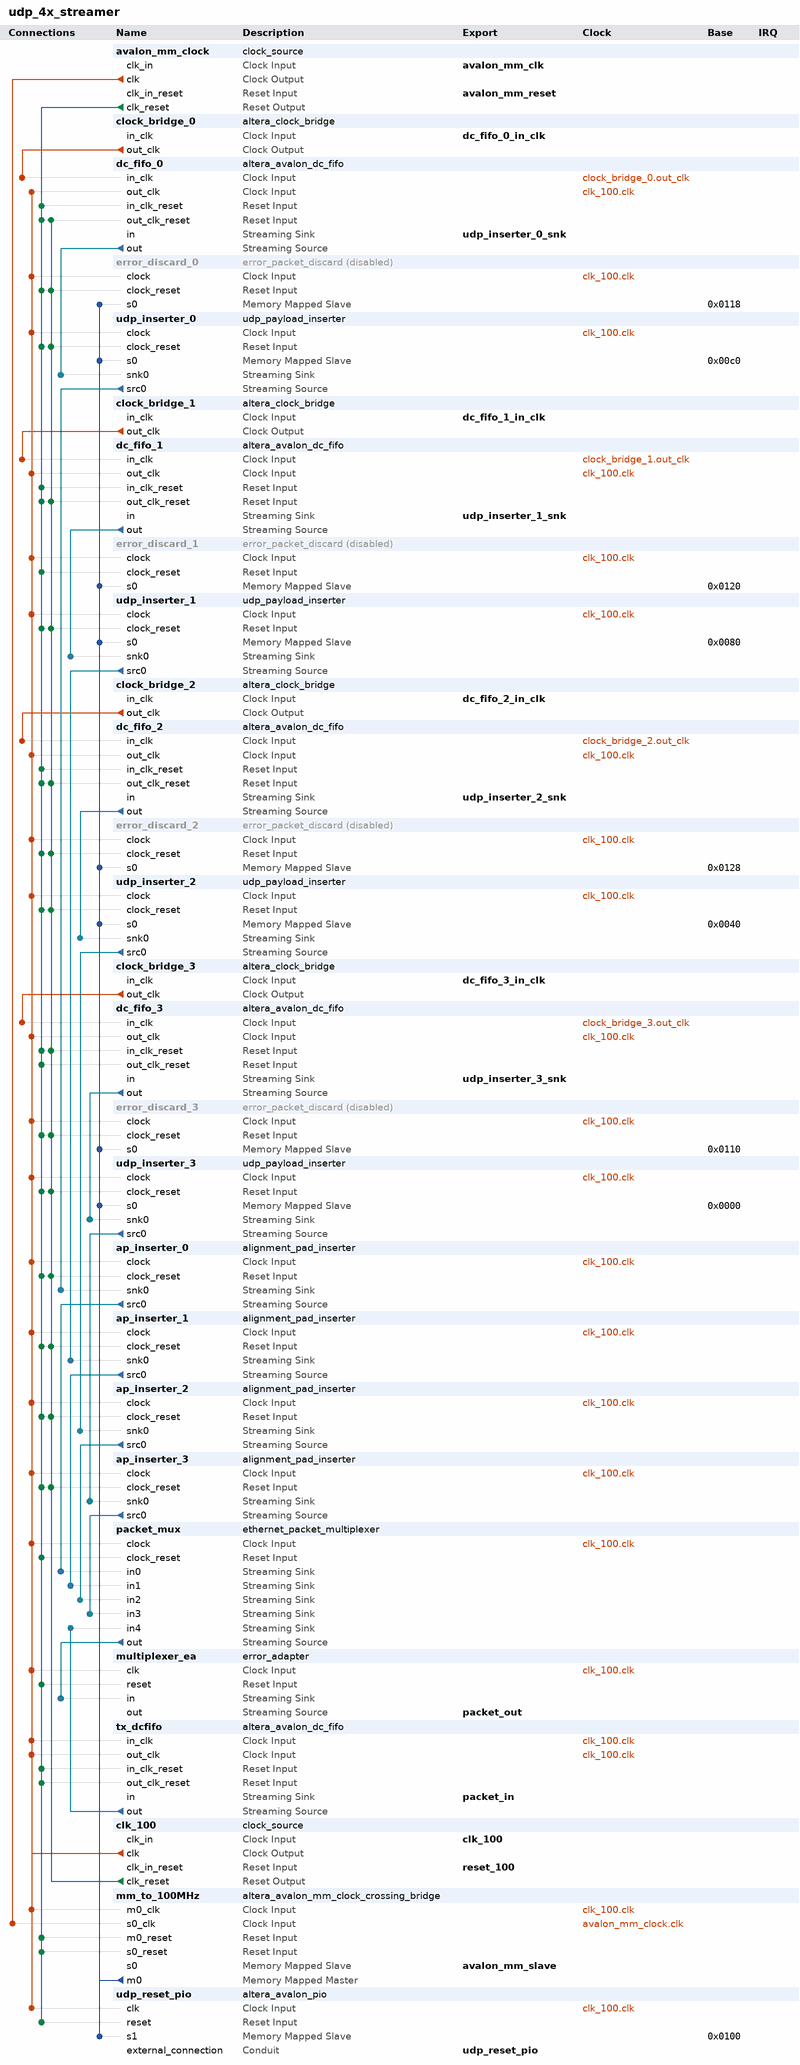
[diagram p0: system contents]
# Platform Designer (Qsys) system udp_4x_streamer, Cyclone V 5CSXFC6D6F31C6
# Parameters at their usual value, and those the tool derives, are not listed.
package require -exact qsys 18.1
create_system udp_4x_streamer
set_project_property DEVICE_FAMILY {Cyclone V}
set_project_property DEVICE 5CSXFC6D6F31C6

add_instance avalon_mm_clock clock_source 18.1
set_instance_parameter_value avalon_mm_clock clockFrequency 50000000

add_instance clock_bridge_0 altera_clock_bridge 18.1
set_instance_parameter_value clock_bridge_0 DERIVED_CLOCK_RATE 0
set_instance_parameter_value clock_bridge_0 EXPLICIT_CLOCK_RATE 0

add_instance dc_fifo_0 altera_avalon_dc_fifo 18.1
set_instance_parameter_value dc_fifo_0 BITS_PER_SYMBOL 8
set_instance_parameter_value dc_fifo_0 FIFO_DEPTH 4096
set_instance_parameter_value dc_fifo_0 SYMBOLS_PER_BEAT 4
set_instance_parameter_value dc_fifo_0 USE_PACKETS 1

add_instance error_discard_0 error_packet_discard 1.0
set_instance_property error_discard_0 ENABLED false

add_instance udp_inserter_0 udp_payload_inserter 1.0

add_instance clock_bridge_1 altera_clock_bridge 18.1
set_instance_parameter_value clock_bridge_1 DERIVED_CLOCK_RATE 0
set_instance_parameter_value clock_bridge_1 EXPLICIT_CLOCK_RATE 0

add_instance dc_fifo_1 altera_avalon_dc_fifo 18.1
set_instance_parameter_value dc_fifo_1 BITS_PER_SYMBOL 8
set_instance_parameter_value dc_fifo_1 FIFO_DEPTH 4096
set_instance_parameter_value dc_fifo_1 SYMBOLS_PER_BEAT 4
set_instance_parameter_value dc_fifo_1 USE_PACKETS 1

add_instance error_discard_1 error_packet_discard 1.0
set_instance_property error_discard_1 ENABLED false

add_instance udp_inserter_1 udp_payload_inserter 1.0

add_instance clock_bridge_2 altera_clock_bridge 18.1
set_instance_parameter_value clock_bridge_2 DERIVED_CLOCK_RATE 0
set_instance_parameter_value clock_bridge_2 EXPLICIT_CLOCK_RATE 0

add_instance dc_fifo_2 altera_avalon_dc_fifo 18.1
set_instance_parameter_value dc_fifo_2 BITS_PER_SYMBOL 8
set_instance_parameter_value dc_fifo_2 FIFO_DEPTH 4096
set_instance_parameter_value dc_fifo_2 SYMBOLS_PER_BEAT 4
set_instance_parameter_value dc_fifo_2 USE_PACKETS 1

add_instance error_discard_2 error_packet_discard 1.0
set_instance_property error_discard_2 ENABLED false

add_instance udp_inserter_2 udp_payload_inserter 1.0

add_instance clock_bridge_3 altera_clock_bridge 18.1
set_instance_parameter_value clock_bridge_3 DERIVED_CLOCK_RATE 0
set_instance_parameter_value clock_bridge_3 EXPLICIT_CLOCK_RATE 0

add_instance dc_fifo_3 altera_avalon_dc_fifo 18.1
set_instance_parameter_value dc_fifo_3 BITS_PER_SYMBOL 8
set_instance_parameter_value dc_fifo_3 FIFO_DEPTH 4096
set_instance_parameter_value dc_fifo_3 SYMBOLS_PER_BEAT 4
set_instance_parameter_value dc_fifo_3 USE_PACKETS 1

add_instance error_discard_3 error_packet_discard 1.0
set_instance_property error_discard_3 ENABLED false

add_instance udp_inserter_3 udp_payload_inserter 1.0

add_instance ap_inserter_0 alignment_pad_inserter 1.0

add_instance ap_inserter_1 alignment_pad_inserter 1.0

add_instance ap_inserter_2 alignment_pad_inserter 1.0

add_instance ap_inserter_3 alignment_pad_inserter 1.0

add_instance packet_mux ethernet_packet_multiplexer 1.0

add_instance multiplexer_ea error_adapter 18.1
set_instance_parameter_value multiplexer_ea inBitsPerSymbol 8
set_instance_parameter_value multiplexer_ea inChannelWidth 0
set_instance_parameter_value multiplexer_ea inErrorWidth 0
set_instance_parameter_value multiplexer_ea inMaxChannel 0
set_instance_parameter_value multiplexer_ea inReadyLatency 0
set_instance_parameter_value multiplexer_ea inSymbolsPerBeat 4
set_instance_parameter_value multiplexer_ea inUseEmpty false
set_instance_parameter_value multiplexer_ea inUseEmptyPort AUTO
set_instance_parameter_value multiplexer_ea inUsePackets true
set_instance_parameter_value multiplexer_ea inUseReady true
set_instance_parameter_value multiplexer_ea outErrorWidth 1

add_instance tx_dcfifo altera_avalon_dc_fifo 18.1
set_instance_parameter_value tx_dcfifo BITS_PER_SYMBOL 8
set_instance_parameter_value tx_dcfifo FIFO_DEPTH 2048
set_instance_parameter_value tx_dcfifo RD_SYNC_DEPTH 2
set_instance_parameter_value tx_dcfifo SYMBOLS_PER_BEAT 4
set_instance_parameter_value tx_dcfifo USE_PACKETS 1
set_instance_parameter_value tx_dcfifo WR_SYNC_DEPTH 2

add_instance clk_100 clock_source 18.1
set_instance_parameter_value clk_100 clockFrequency 100000000

add_instance mm_to_100MHz altera_avalon_mm_clock_crossing_bridge 18.1
set_instance_parameter_value mm_to_100MHz ADDRESS_WIDTH 24
set_instance_parameter_value mm_to_100MHz COMMAND_FIFO_DEPTH 4
set_instance_parameter_value mm_to_100MHz DATA_WIDTH 32
set_instance_parameter_value mm_to_100MHz MASTER_SYNC_DEPTH 3
set_instance_parameter_value mm_to_100MHz MAX_BURST_SIZE 1
set_instance_parameter_value mm_to_100MHz RESPONSE_FIFO_DEPTH 4
set_instance_parameter_value mm_to_100MHz SLAVE_SYNC_DEPTH 3
set_instance_parameter_value mm_to_100MHz USE_AUTO_ADDRESS_WIDTH 1

add_instance udp_reset_pio altera_avalon_pio 18.1
set_instance_parameter_value udp_reset_pio direction Output
set_instance_parameter_value udp_reset_pio resetValue 1
set_instance_parameter_value udp_reset_pio width 8

# connections
add_connection avalon_mm_clock.clk mm_to_100MHz.s0_clk clock
add_connection clk_100.clk ap_inserter_0.clock clock
add_connection clk_100.clk ap_inserter_1.clock clock
add_connection clk_100.clk ap_inserter_2.clock clock
add_connection clk_100.clk ap_inserter_3.clock clock
add_connection clk_100.clk dc_fifo_0.out_clk clock
add_connection clk_100.clk dc_fifo_1.out_clk clock
add_connection clk_100.clk dc_fifo_2.out_clk clock
add_connection clk_100.clk dc_fifo_3.out_clk clock
add_connection clk_100.clk error_discard_0.clock clock
add_connection clk_100.clk error_discard_1.clock clock
add_connection clk_100.clk error_discard_2.clock clock
add_connection clk_100.clk error_discard_3.clock clock
add_connection clk_100.clk mm_to_100MHz.m0_clk clock
add_connection clk_100.clk multiplexer_ea.clk clock
add_connection clk_100.clk packet_mux.clock clock
add_connection clk_100.clk tx_dcfifo.in_clk clock
add_connection clk_100.clk tx_dcfifo.out_clk clock
add_connection clk_100.clk udp_inserter_0.clock clock
add_connection clk_100.clk udp_inserter_1.clock clock
add_connection clk_100.clk udp_inserter_2.clock clock
add_connection clk_100.clk udp_inserter_3.clock clock
add_connection clk_100.clk udp_reset_pio.clk clock
add_connection clock_bridge_0.out_clk dc_fifo_0.in_clk clock
add_connection clock_bridge_1.out_clk dc_fifo_1.in_clk clock
add_connection clock_bridge_2.out_clk dc_fifo_2.in_clk clock
add_connection clock_bridge_3.out_clk dc_fifo_3.in_clk clock
add_connection avalon_mm_clock.clk_reset ap_inserter_0.clock_reset reset
add_connection avalon_mm_clock.clk_reset ap_inserter_1.clock_reset reset
add_connection avalon_mm_clock.clk_reset ap_inserter_2.clock_reset reset
add_connection avalon_mm_clock.clk_reset ap_inserter_3.clock_reset reset
add_connection avalon_mm_clock.clk_reset dc_fifo_0.in_clk_reset reset
add_connection avalon_mm_clock.clk_reset dc_fifo_0.out_clk_reset reset
add_connection avalon_mm_clock.clk_reset dc_fifo_1.in_clk_reset reset
add_connection avalon_mm_clock.clk_reset dc_fifo_1.out_clk_reset reset
add_connection avalon_mm_clock.clk_reset dc_fifo_2.in_clk_reset reset
add_connection avalon_mm_clock.clk_reset dc_fifo_2.out_clk_reset reset
add_connection avalon_mm_clock.clk_reset dc_fifo_3.in_clk_reset reset
add_connection avalon_mm_clock.clk_reset dc_fifo_3.out_clk_reset reset
add_connection avalon_mm_clock.clk_reset error_discard_0.clock_reset reset
add_connection avalon_mm_clock.clk_reset error_discard_1.clock_reset reset
add_connection avalon_mm_clock.clk_reset error_discard_2.clock_reset reset
add_connection avalon_mm_clock.clk_reset error_discard_3.clock_reset reset
add_connection avalon_mm_clock.clk_reset mm_to_100MHz.m0_reset reset
add_connection avalon_mm_clock.clk_reset mm_to_100MHz.s0_reset reset
add_connection avalon_mm_clock.clk_reset multiplexer_ea.reset reset
add_connection avalon_mm_clock.clk_reset packet_mux.clock_reset reset
add_connection avalon_mm_clock.clk_reset tx_dcfifo.in_clk_reset reset
add_connection avalon_mm_clock.clk_reset tx_dcfifo.out_clk_reset reset
add_connection avalon_mm_clock.clk_reset udp_inserter_0.clock_reset reset
add_connection avalon_mm_clock.clk_reset udp_inserter_1.clock_reset reset
add_connection avalon_mm_clock.clk_reset udp_inserter_2.clock_reset reset
add_connection avalon_mm_clock.clk_reset udp_inserter_3.clock_reset reset
add_connection avalon_mm_clock.clk_reset udp_reset_pio.reset reset
add_connection clk_100.clk_reset ap_inserter_0.clock_reset reset
add_connection clk_100.clk_reset ap_inserter_1.clock_reset reset
add_connection clk_100.clk_reset ap_inserter_2.clock_reset reset
add_connection clk_100.clk_reset ap_inserter_3.clock_reset reset
add_connection clk_100.clk_reset dc_fifo_0.out_clk_reset reset
add_connection clk_100.clk_reset dc_fifo_1.out_clk_reset reset
add_connection clk_100.clk_reset dc_fifo_2.out_clk_reset reset
add_connection clk_100.clk_reset dc_fifo_3.in_clk_reset reset
add_connection clk_100.clk_reset error_discard_0.clock_reset reset
add_connection clk_100.clk_reset error_discard_2.clock_reset reset
add_connection clk_100.clk_reset error_discard_3.clock_reset reset
add_connection clk_100.clk_reset udp_inserter_0.clock_reset reset
add_connection clk_100.clk_reset udp_inserter_1.clock_reset reset
add_connection clk_100.clk_reset udp_inserter_2.clock_reset reset
add_connection clk_100.clk_reset udp_inserter_3.clock_reset reset
add_connection mm_to_100MHz.m0 error_discard_0.s0 avalon
set_connection_parameter_value mm_to_100MHz.m0/error_discard_0.s0 baseAddress 0x0118
add_connection mm_to_100MHz.m0 error_discard_1.s0 avalon
set_connection_parameter_value mm_to_100MHz.m0/error_discard_1.s0 baseAddress 0x0120
add_connection mm_to_100MHz.m0 error_discard_2.s0 avalon
set_connection_parameter_value mm_to_100MHz.m0/error_discard_2.s0 baseAddress 0x0128
add_connection mm_to_100MHz.m0 error_discard_3.s0 avalon
set_connection_parameter_value mm_to_100MHz.m0/error_discard_3.s0 baseAddress 0x0110
add_connection mm_to_100MHz.m0 udp_inserter_0.s0 avalon
set_connection_parameter_value mm_to_100MHz.m0/udp_inserter_0.s0 baseAddress 0x00c0
add_connection mm_to_100MHz.m0 udp_inserter_1.s0 avalon
set_connection_parameter_value mm_to_100MHz.m0/udp_inserter_1.s0 baseAddress 0x0080
add_connection mm_to_100MHz.m0 udp_inserter_2.s0 avalon
set_connection_parameter_value mm_to_100MHz.m0/udp_inserter_2.s0 baseAddress 0x0040
add_connection mm_to_100MHz.m0 udp_inserter_3.s0 avalon
set_connection_parameter_value mm_to_100MHz.m0/udp_inserter_3.s0 baseAddress 0x0000
add_connection mm_to_100MHz.m0 udp_reset_pio.s1 avalon
set_connection_parameter_value mm_to_100MHz.m0/udp_reset_pio.s1 baseAddress 0x0100
add_connection ap_inserter_0.src0 packet_mux.in0 avalon_streaming
add_connection ap_inserter_1.src0 packet_mux.in1 avalon_streaming
add_connection ap_inserter_2.src0 packet_mux.in2 avalon_streaming
add_connection ap_inserter_3.src0 packet_mux.in3 avalon_streaming
add_connection dc_fifo_0.out udp_inserter_0.snk0 avalon_streaming
add_connection dc_fifo_1.out udp_inserter_1.snk0 avalon_streaming
add_connection dc_fifo_2.out udp_inserter_2.snk0 avalon_streaming
add_connection dc_fifo_3.out udp_inserter_3.snk0 avalon_streaming
add_connection packet_mux.out multiplexer_ea.in avalon_streaming
add_connection tx_dcfifo.out packet_mux.in4 avalon_streaming
add_connection udp_inserter_0.src0 ap_inserter_0.snk0 avalon_streaming
add_connection udp_inserter_1.src0 ap_inserter_1.snk0 avalon_streaming
add_connection udp_inserter_2.src0 ap_inserter_2.snk0 avalon_streaming
add_connection udp_inserter_3.src0 ap_inserter_3.snk0 avalon_streaming

# exported interfaces
add_interface avalon_mm_clk clock sink
set_interface_property avalon_mm_clk EXPORT_OF avalon_mm_clock.clk_in
add_interface avalon_mm_reset reset sink
set_interface_property avalon_mm_reset EXPORT_OF avalon_mm_clock.clk_in_reset
add_interface avalon_mm_slave avalon slave
set_interface_property avalon_mm_slave EXPORT_OF mm_to_100MHz.s0
add_interface clk_100 clock sink
set_interface_property clk_100 EXPORT_OF clk_100.clk_in
add_interface dc_fifo_0_in_clk clock sink
set_interface_property dc_fifo_0_in_clk EXPORT_OF clock_bridge_0.in_clk
add_interface dc_fifo_1_in_clk clock sink
set_interface_property dc_fifo_1_in_clk EXPORT_OF clock_bridge_1.in_clk
add_interface dc_fifo_2_in_clk clock sink
set_interface_property dc_fifo_2_in_clk EXPORT_OF clock_bridge_2.in_clk
add_interface dc_fifo_3_in_clk clock sink
set_interface_property dc_fifo_3_in_clk EXPORT_OF clock_bridge_3.in_clk
add_interface packet_in avalon_streaming sink
set_interface_property packet_in EXPORT_OF tx_dcfifo.in
add_interface packet_out avalon_streaming source
set_interface_property packet_out EXPORT_OF multiplexer_ea.out
add_interface reset_100 reset sink
set_interface_property reset_100 EXPORT_OF clk_100.clk_in_reset
add_interface udp_inserter_0_snk avalon_streaming sink
set_interface_property udp_inserter_0_snk EXPORT_OF dc_fifo_0.in
add_interface udp_inserter_1_snk avalon_streaming sink
set_interface_property udp_inserter_1_snk EXPORT_OF dc_fifo_1.in
add_interface udp_inserter_2_snk avalon_streaming sink
set_interface_property udp_inserter_2_snk EXPORT_OF dc_fifo_2.in
add_interface udp_inserter_3_snk avalon_streaming sink
set_interface_property udp_inserter_3_snk EXPORT_OF dc_fifo_3.in
add_interface udp_reset_pio conduit end
set_interface_property udp_reset_pio EXPORT_OF udp_reset_pio.external_connection

set_interconnect_requirement {$system} qsys_mm.clockCrossingAdapter AUTO
set_interconnect_requirement {$system} qsys_mm.maxAdditionalLatency 3

save_system udp_4x_streamer.qsys
